# Altium schematic sheet QCopterFC_NRF_Sch.SchDoc
size A4
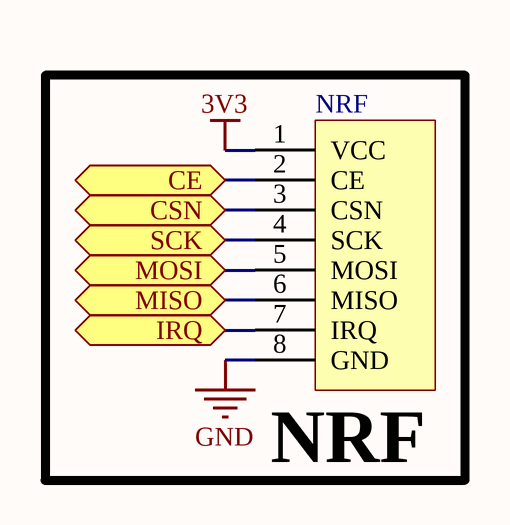
[diagram p0: QCopterFC_NRF_Sch.SchDoc]

## Parts
NRF  nRF24L01P_PA_LNA  [NRF24L01P_PA_LNA]  (value not drawn)

## Blocks framed on the sheet
NRF: NRF

## Ports
CE, CSN, IRQ, MISO, MOSI, SCK

## Nets
3V3: NRF.1(VCC)
GND: NRF.8(GND)
CE: NRF.2(CE) ; port CE
CSN: NRF.3(CSN) ; port CSN
IRQ: NRF.7(IRQ) ; port IRQ
MISO: NRF.6(MISO) ; port MISO
MOSI: NRF.5(MOSI) ; port MOSI
SCK: NRF.4(SCK) ; port SCK

## Library data of the parts
NRF = nRF24L01P_PA_LNA: Module